# Altium schematic sheet feedback.SchDoc: foxBMS BMS-Slave 12-Cell
size A3; DocumentNumber: 6; SheetNumber: 6; SheetTotal: 15; AUTHOR: Fraunhofer IISB foxBMS Team; SheetDescription: Passive Balancing Feedback
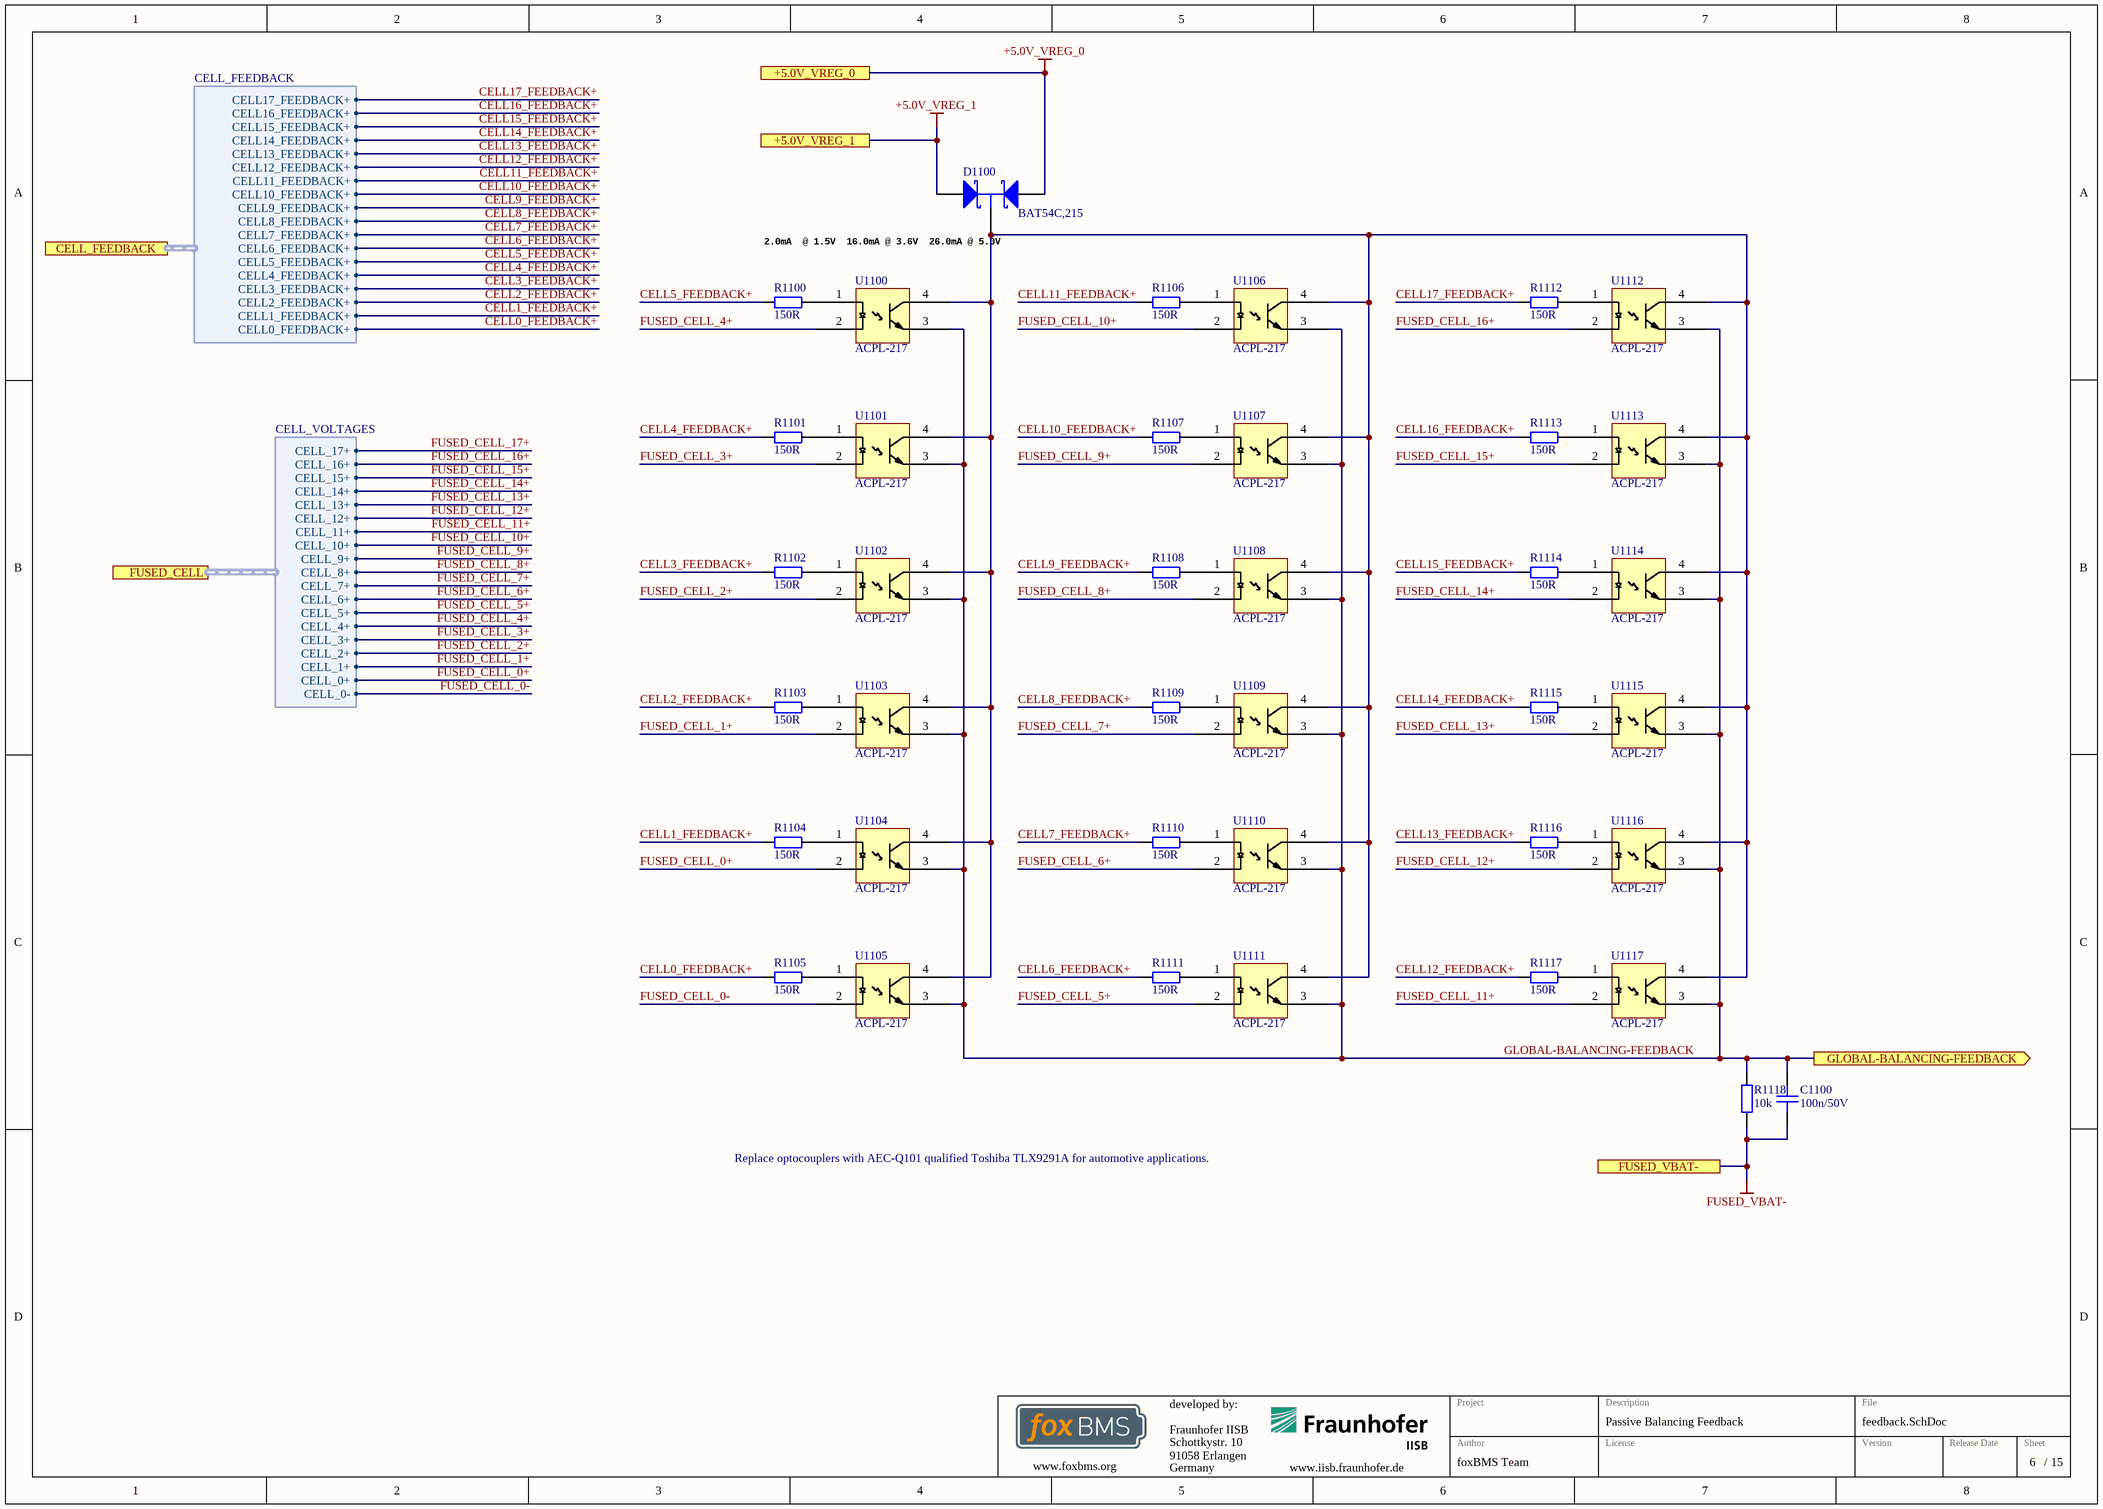
[diagram p0: feedback.SchDoc]

## Parts
C1100  100n/50V  [CAPC1608X08N]
D1100  BAT54C,215  [NXP-SOT23-3_V]
R1100  150R  [RESC1608X05N]
R1101  150R  [RESC1608X05N]
R1102  150R  [RESC1608X05N]
R1103  150R  [RESC1608X05N]
R1104  150R  [RESC1608X05N]
R1105  150R  [RESC1608X05N]
R1106  150R  [RESC1608X05N]
R1107  150R  [RESC1608X05N]
R1108  150R  [RESC1608X05N]
R1109  150R  [RESC1608X05N]
R1110  150R  [RESC1608X05N]
R1111  150R  [RESC1608X05N]
R1112  150R  [RESC1608X05N]
R1113  150R  [RESC1608X05N]
R1114  150R  [RESC1608X05N]
R1115  150R  [RESC1608X05N]
R1116  150R  [RESC1608X05N]
R1117  150R  [RESC1608X05N]
R1118  10k  [RESC1608X05N]
U1100  ACPL-217  [SOIC127P700X220-4N]
U1101  ACPL-217  [SOIC127P700X220-4N]
U1102  ACPL-217  [SOIC127P700X220-4N]
U1103  ACPL-217  [SOIC127P700X220-4N]
U1104  ACPL-217  [SOIC127P700X220-4N]
U1105  ACPL-217  [SOIC127P700X220-4N]
U1106  ACPL-217  [SOIC127P700X220-4N]
U1107  ACPL-217  [SOIC127P700X220-4N]
U1108  ACPL-217  [SOIC127P700X220-4N]
U1109  ACPL-217  [SOIC127P700X220-4N]
U1110  ACPL-217  [SOIC127P700X220-4N]
U1111  ACPL-217  [SOIC127P700X220-4N]
U1112  ACPL-217  [SOIC127P700X220-4N]
U1113  ACPL-217  [SOIC127P700X220-4N]
U1114  ACPL-217  [SOIC127P700X220-4N]
U1115  ACPL-217  [SOIC127P700X220-4N]
U1116  ACPL-217  [SOIC127P700X220-4N]
U1117  ACPL-217  [SOIC127P700X220-4N]

## Ports
+5.0V_VREG_0, +5.0V_VREG_1, CELL_FEEDBACK (harness CELL_FEEDBACK), FUSED_CELL (harness CELL_VOLTAGES), FUSED_VBAT-, GLOBAL-BALANCING-FEEDBACK (out)

## Harnesses
CELL_VOLTAGES: CELL_0-, CELL_0+, CELL_1+, CELL_10+, CELL_11+, CELL_12+, CELL_13+, CELL_14+, CELL_15+, CELL_16+, CELL_17+, CELL_2+, CELL_3+, CELL_4+, CELL_5+, CELL_6+, CELL_7+, CELL_8+, CELL_9+
CELL_FEEDBACK: CELL11_FEEDBACK+, CELL10_FEEDBACK+, CELL9_FEEDBACK+, CELL8_FEEDBACK+, CELL7_FEEDBACK+, CELL6_FEEDBACK+, CELL5_FEEDBACK+, CELL4_FEEDBACK+, CELL3_FEEDBACK+, CELL2_FEEDBACK+, CELL1_FEEDBACK+, CELL0_FEEDBACK+, CELL12_FEEDBACK+, CELL13_FEEDBACK+, CELL14_FEEDBACK+, CELL15_FEEDBACK+, CELL16_FEEDBACK+, CELL17_FEEDBACK+

## Nets
+5.0V_VREG_0: D1100.2(A) ; port +5.0V_VREG_0
+5.0V_VREG_1: D1100.1(A) ; port +5.0V_VREG_1
FUSED_VBAT-: C1100.1 R1118.2 ; port FUSED_VBAT-
CELL0_FEEDBACK+: R1105.1 ; port CELL_FEEDBACK.CELL0_FEEDBACK+
CELL1_FEEDBACK+: R1104.1 ; port CELL_FEEDBACK.CELL1_FEEDBACK+
CELL2_FEEDBACK+: R1103.1 ; port CELL_FEEDBACK.CELL2_FEEDBACK+
CELL3_FEEDBACK+: R1102.1 ; port CELL_FEEDBACK.CELL3_FEEDBACK+
CELL4_FEEDBACK+: R1101.1 ; port CELL_FEEDBACK.CELL4_FEEDBACK+
CELL5_FEEDBACK+: R1100.1 ; port CELL_FEEDBACK.CELL5_FEEDBACK+
CELL6_FEEDBACK+: R1111.1 ; port CELL_FEEDBACK.CELL6_FEEDBACK+
CELL7_FEEDBACK+: R1110.1 ; port CELL_FEEDBACK.CELL7_FEEDBACK+
CELL8_FEEDBACK+: R1109.1 ; port CELL_FEEDBACK.CELL8_FEEDBACK+
CELL9_FEEDBACK+: R1108.1 ; port CELL_FEEDBACK.CELL9_FEEDBACK+
CELL10_FEEDBACK+: R1107.1 ; port CELL_FEEDBACK.CELL10_FEEDBACK+
CELL11_FEEDBACK+: R1106.1 ; port CELL_FEEDBACK.CELL11_FEEDBACK+
CELL12_FEEDBACK+: R1117.1 ; port CELL_FEEDBACK.CELL12_FEEDBACK+
CELL13_FEEDBACK+: R1116.1 ; port CELL_FEEDBACK.CELL13_FEEDBACK+
CELL14_FEEDBACK+: R1115.1 ; port CELL_FEEDBACK.CELL14_FEEDBACK+
CELL15_FEEDBACK+: R1114.1 ; port CELL_FEEDBACK.CELL15_FEEDBACK+
CELL16_FEEDBACK+: R1113.1 ; port CELL_FEEDBACK.CELL16_FEEDBACK+
CELL17_FEEDBACK+: R1112.1 ; port CELL_FEEDBACK.CELL17_FEEDBACK+
FUSED_CELL_0+: U1104.2 ; port FUSED_CELL.CELL_0+
FUSED_CELL_0-: U1105.2 ; port FUSED_CELL.CELL_0-
FUSED_CELL_1+: U1103.2 ; port FUSED_CELL.CELL_1+
FUSED_CELL_2+: U1102.2 ; port FUSED_CELL.CELL_2+
FUSED_CELL_3+: U1101.2 ; port FUSED_CELL.CELL_3+
FUSED_CELL_4+: U1100.2 ; port FUSED_CELL.CELL_4+
FUSED_CELL_5+: U1111.2 ; port FUSED_CELL.CELL_5+
FUSED_CELL_6+: U1110.2 ; port FUSED_CELL.CELL_6+
FUSED_CELL_7+: U1109.2 ; port FUSED_CELL.CELL_7+
FUSED_CELL_8+: U1108.2 ; port FUSED_CELL.CELL_8+
FUSED_CELL_9+: U1107.2 ; port FUSED_CELL.CELL_9+
FUSED_CELL_10+: U1106.2 ; port FUSED_CELL.CELL_10+
FUSED_CELL_11+: U1117.2 ; port FUSED_CELL.CELL_11+
FUSED_CELL_12+: U1116.2 ; port FUSED_CELL.CELL_12+
FUSED_CELL_13+: U1115.2 ; port FUSED_CELL.CELL_13+
FUSED_CELL_14+: U1114.2 ; port FUSED_CELL.CELL_14+
FUSED_CELL_15+: U1113.2 ; port FUSED_CELL.CELL_15+
FUSED_CELL_16+: U1112.2 ; port FUSED_CELL.CELL_16+
FUSED_CELL_17+: port FUSED_CELL.CELL_17+
GLOBAL-BALANCING-FEEDBACK: C1100.2 R1118.1 U1100.3 U1101.3 U1102.3 U1103.3 U1104.3 U1105.3 U1106.3 U1107.3 U1108.3 U1109.3 U1110.3 U1111.3 U1112.3 U1113.3 U1114.3 U1115.3 U1116.3 U1117.3 ; port GLOBAL-BALANCING-FEEDBACK
NetD1100_3: D1100.3(K) U1100.4 U1101.4 U1102.4 U1103.4 U1104.4 U1105.4 U1106.4 U1107.4 U1108.4 U1109.4 U1110.4 U1111.4 U1112.4 U1113.4 U1114.4 U1115.4 U1116.4 U1117.4
NetR1100_2: R1100.2 U1100.1
NetR1101_2: R1101.2 U1101.1
NetR1102_2: R1102.2 U1102.1
NetR1103_2: R1103.2 U1103.1
NetR1104_2: R1104.2 U1104.1
NetR1105_2: R1105.2 U1105.1
NetR1106_2: R1106.2 U1106.1
NetR1107_2: R1107.2 U1107.1
NetR1108_2: R1108.2 U1108.1
NetR1109_2: R1109.2 U1109.1
NetR1110_2: R1110.2 U1110.1
NetR1111_2: R1111.2 U1111.1
NetR1112_2: R1112.2 U1112.1
NetR1113_2: R1113.2 U1113.1
NetR1114_2: R1114.2 U1114.1
NetR1115_2: R1115.2 U1115.1
NetR1116_2: R1116.2 U1116.1
NetR1117_2: R1117.2 U1117.1

## Notes on the sheet
- (near D1100) 2.0mA  @ 1.5V
  16.0mA @ 3.6V
  26.0mA @ 5.0V
- Replace optocouplers with AEC-Q101 qualified Toshiba TLX9291A for automotive applications.
- Fraunhofer IISB
- Schottkystr. 10
- developed by:
- 91058 Erlangen
- Germany
- Author
- Project
- License
- Description
- File
- Version
- Release Date
- Sheet
- www.foxbms.org
- www.iisb.fraunhofer.de
- foxBMS Team
- /

## Library data of the parts
C1100 = gen_C_ceramic_100n_50V_X7R_0603: MLCC; Capacitance: 100n; Rated Voltage: 50V; Dielectric: X7R; Case EIA: 0603; Case Metric: 1608; PnP Package: C_0603_10; PnP Value: 100n/50V/X7R; PnP equipped: x; Automotive Qualified: True; Part Number: gen_C_ceramic_100n_50V_X7R_0603; Supplier 1: Farnell; Supplier Part Number 1: 2525267; Supplier 2: Digikey; Supplier Part Number 2: 490-6049-1-ND; Supplier 3: Farnell; Supplier Part Number 3: 2070398
D1100 = CMP-2000-04915-1: Schottky Barrier Diode, 30 V, 3-Pin SOT23, RoHS, Tape and Reel; Manufacturer: NXP Semiconductors; Forward Surge Current Ifsm Max: 600mA; Pin Configuration: 1A1,2A2,3comK; Package Version: Feb-16; Forward Voltage VF Max: 800mV; SMD Marking: L43/*W1; Diode Case Style: SOT-23; Reverse Recovery Time trr Typ: 5ns; Forward Current If(AV): 200mA; Reel Quantity: 3000; SVHC: NoSVHC(19-Dec-2012); No. of Pins: 3; Junction Temperature Tj Max: 125degC; Common Connection: Cathode; Repetitive Reverse Voltage Vrrm Max: 30V; Operating Temperature Max: 150degC; Operating Temperature Range: -65degCto+150degC; Termination Type: SMD; Package Description: 3-Pin Small Outline Transistor, Body 1.3 x 2.9 mm, Pitch 0.95 mm; Package / Case: SOT-23; Diode Type: Schottky; Manufacturer URL: http://www.nxp.com/; Tape Width: 8mm; Package Reference: SOT23-3; Datasheet URL: https://datasheet.ciiva.com/33723/1668625-33723936.pdf; Datasheet Version: Rev. 5 , 10/2012; Operating Temperature Min: -65degC; Current Ifsm: 600mA; Reverse Recovery Time trr Max: 5ns; Package URL: http://www.nxp.com/documents/outline_drawing/SOT23.pdf; Forward Voltage: 800mV
R1100-R1117 = gen_R_150R_0603: SMD Resistor 150R 0603; Tolerance: 1%; Power: 0.1W; Case EIA: 0603; Case Metric: 1608; Maximum Working Voltage: 75V; PnP Package: R_0603; Automotive Qualified: True; Part Number: gen_R_150R_0603; Operating Temperature: -55°C - +155°C; Resistance: 150R; Series: E24, E96; PnP Value: 150R; Supplier 1: Farnell; Supplier Part Number 1: 2303076
R1118 = gen_R_10k_0603: SMD Resistor 10k 0603; Tolerance: 1%; Power: 0.1W; Case EIA: 0603; Case Metric: 1608; Maximum Working Voltage: 75V; PnP Package: R_0603; Automotive Qualified: True; Part Number: gen_R_10k_0603; Operating Temperature: -55°C - +155°C; Resistance: 10k; Series: E24, E96; PnP Value: 10k; Supplier 1: Farnell; Supplier Part Number 1: 2073349
U1100-U1117 = ACPL-217-56BE: Optocoupler, Transistor Output, 1 Channel; Manufacturer: Broadcom Limited; Automotive Qualified: False; Part Number: ACPL-217-56BE; Part Name: ACPL-217; Operating Temperature: -55°C - +110°C; ComponentLink1Description: Datenblatt; ComponentLink1URL: http://www.farnell.com/datasheets/45634.pdf; Supplier 1: Farnell; Supplier Part Number 1: 1602623